# Altium schematic sheet MCU INTERFACE.SchDoc
size OrCAD B; SheetNumber: 1; SheetTotal: 7
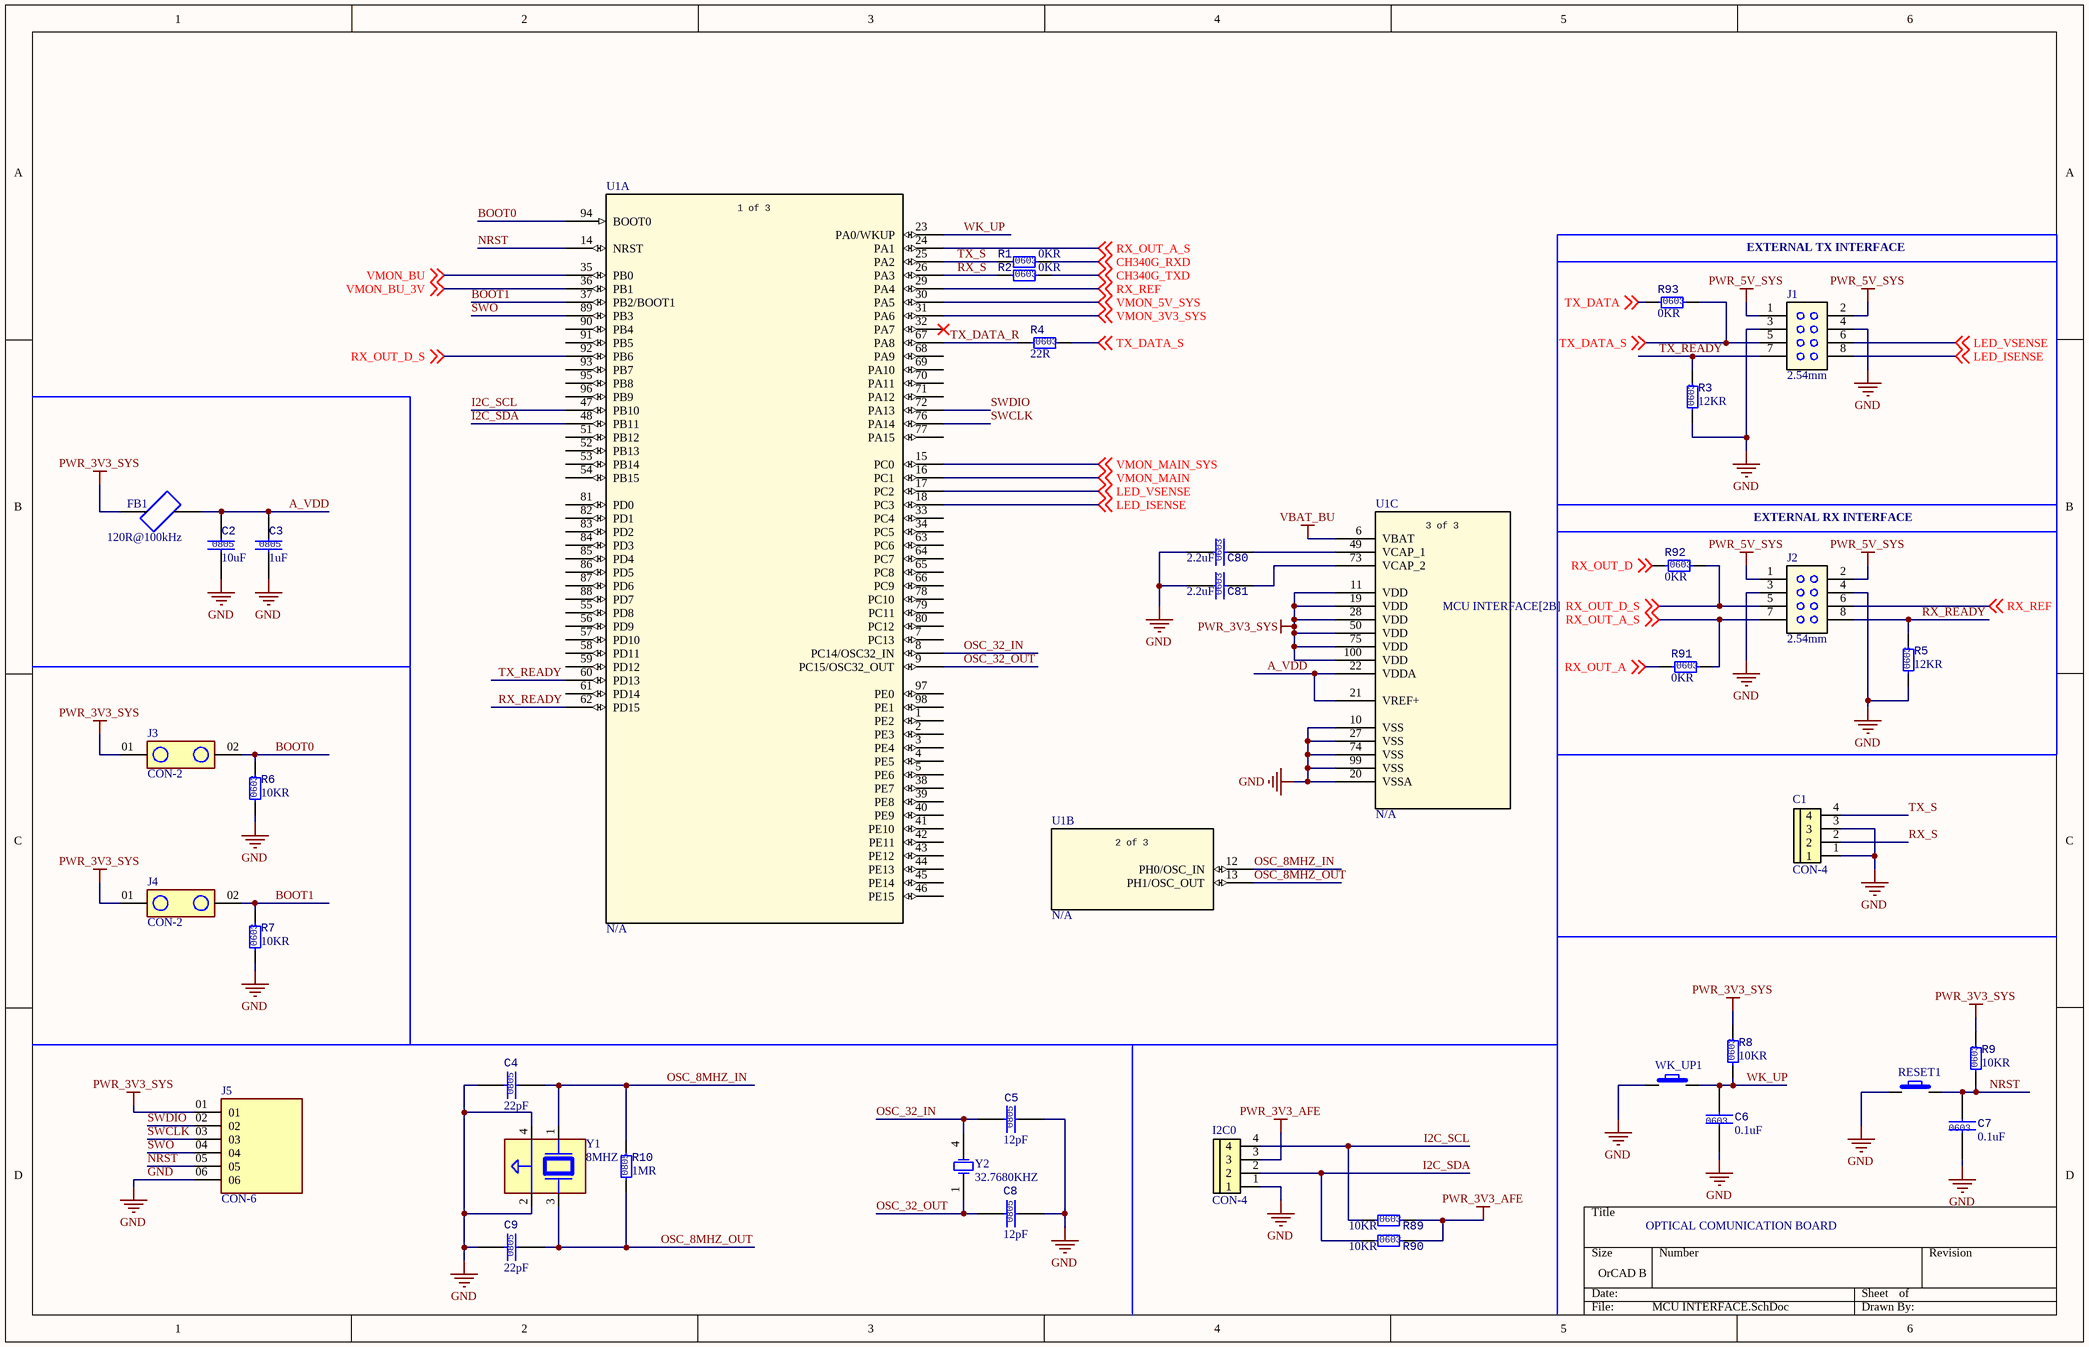
[diagram p0: MCU INTERFACE.SchDoc]

## Parts
C1  value CON-4  [CON-4]  (hidden comment: CONNECTOR_4)
C2  Size: 0805  [CAPCER 0603 SMD]  (hidden comment: 10uF)
C3  Size: 0805  [CAPCER 0805 SMD]  (hidden comment: 1uF)
C4  value 22pF  Size: 0805  [CAPCER 0805 SMD]  (hidden comment: 22uF)
C5  Size: 0805  [CAPCER 0805 SMD]  (hidden comment: 12pF)
C6  Size: 0603  [CAPCER 0805 SMD]  (hidden comment: 0.1uF)
C7  Size: 0603  [CAPCER 0805 SMD]  (hidden comment: 0.1uF)
C8  Size: 0805  [CAPCER 0805 SMD]  (hidden comment: 12pF)
C9  value 22pF  Size: 0805  [CAPCER 0805 SMD]  (hidden comment: 22uF)
C80  Size: 0603  [CAPCER 0603 SMD]  (hidden comment: 2.2uF)
C81  Size: 0603  [CAPCER 0603 SMD]  (hidden comment: 2.2uF)
FB1  120R@100kHz  [FB 0805]
I2C0  value CON-4  [CON-4]  (hidden comment: CONNECTOR_4)
J1  value 2.54mm  [HD_2X4_2P54_M_V]  (hidden comment: HD_2X4_M_V)
J2  value 2.54mm  [HD_2X4_2P54_M_V]  (hidden comment: HD_2X4_M_V)
J3  value CON-2  [CON-2]  (hidden comment: CONNECTOR_2)
J4  value CON-2  [CON-2]  (hidden comment: CONNECTOR_2)
J5  value CON-6  [CON-6]  (hidden comment: CONNECTOR_6)
R1  value 0KR  Size: 0603  [RESC 0603(1608) SMD]  (hidden comment: 0R)
R2  value 0KR  Size: 0603  [RESC 0603(1608) SMD]  (hidden comment: 0R)
R3  Size: 0603  [RESC 0603(1608) SMD]  (hidden comment: 12KR)
R4  Size: 0603  [RESC 0603(1608) SMD]  (hidden comment: 22R)
R5  Size: 0603  [RESC 0603(1608) SMD]  (hidden comment: 12KR)
R6  Size: 0603  [RESC 0603(1608) SMD]  (hidden comment: 10KR)
R7  Size: 0603  [RESC 0603(1608) SMD]  (hidden comment: 10KR)
R8  Size: 0603  [RESC 0603(1608) SMD]  (hidden comment: 10KR)
R9  Size: 0603  [RESC 0603(1608) SMD]  (hidden comment: 10KR)
R10  value 1MR  Size: 0805  [CAPCER 0805 SMD]  (hidden comment: Điện Trở 1 MOhm 0805 1%)
R89  Size: 0603  [RESC 0603(1608) SMD]  (hidden comment: 10KR)
R90  Size: 0603  [RESC 0603(1608) SMD]  (hidden comment: 10KR)
R91  value 0KR  Size: 0603  [RESC 0603(1608) SMD]  (hidden comment: 0R)
R92  value 0KR  Size: 0603  [RESC 0603(1608) SMD]  (hidden comment: 0R)
R93  value 0KR  Size: 0603  [RESC 0603(1608) SMD]  (hidden comment: 0R)
RESET1  BUTTON  [BUTTON_SMD]  (value not drawn)
U1  STM32F407VET6  [100LQFP]  (value not drawn)  (parts A,B,C of 3)
WK_UP1  BUTTON  [BUTTON_SMD]  (value not drawn)
Y1  value 8MHZ  [XTAL_5032]  (hidden comment: XTAL_8Mhz)
Y2  value 32.7680KHZ  [4-SOJ]  (hidden comment: XTAL_32.786K)

## Nets
GND: C1.1 C1.3 C2.2 C3.2 C4.1 C5.2 C6.1 C7.1 C8.2 C9.1 C80.1 C81.1 I2C0.1 J1.3 J1.4 J2.3 J2.4 J5.06 R3.1 R5.1 R6.1 R7.1 RESET1.1 U1.10(VSS) U1.20(VSSA) U1.27(VSS) U1.74(VSS) U1.99(VSS) WK_UP1.1 Y1.2(GND) Y1.4(GND)
PWR_3V3_AFE: I2C0.3 R89.2 R90.2
PWR_3V3_SYS: FB1.1 J3.01 J4.01 J5.01 R8.2 R9.2 U1.11(VDD) U1.19(VDD) U1.28(VDD) U1.50(VDD) U1.75(VDD) U1.100(VDD)
PWR_5V_SYS: J1.1 J1.2 J2.1 J2.2
VBAT_BU: U1.6(VBAT)
A_VDD: C2.1 C3.1 FB1.2 U1.21(VREF+) U1.22(VDDA)
BOOT0: J3.02 R6.2 U1.94(BOOT0)
BOOT1: J4.02 R7.2 U1.37(PB2/BOOT1)
CH340G_RXD: R1.2 ; off-sheet CH340G_RXD
CH340G_TXD: R2.2 ; off-sheet CH340G_TXD
I2C_SCL: I2C0.4 R89.1 U1.47(PB10)
I2C_SDA: I2C0.2 R90.1 U1.48(PB11)
LED_ISENSE: J1.8 U1.18(PC3) ; off-sheet LED_ISENSE
LED_VSENSE: J1.6 U1.17(PC2) ; off-sheet LED_VSENSE
NRST: C7.2 J5.05 R9.1 RESET1.2 U1.14(NRST)
OSC_8MHZ_IN: C4.2 R10.2 U1.12(PH0/OSC_IN) Y1.1
OSC_8MHZ_OUT: C9.2 R10.1 U1.13(PH1/OSC_OUT) Y1.3
OSC_32_IN: C5.1 U1.8(PC14/OSC32_IN) Y2.4(OSC2)
OSC_32_OUT: C8.1 U1.9(PC15/OSC32_OUT) Y2.1(OSC1)
RX_OUT_A: R91.1 ; off-sheet RX_OUT_A
RX_OUT_A_S: J2.7 R91.2 U1.24(PA1) ; off-sheet RX_OUT_A_S
RX_OUT_D: R92.1 ; off-sheet RX_OUT_D
RX_OUT_D_S: J2.5 R92.2 U1.92(PB6) ; off-sheet RX_OUT_D_S
RX_READY: J2.8 R5.2 U1.62(PD15)
RX_REF: J2.6 U1.29(PA4) ; off-sheet RX_REF
RX_S: C1.2 R2.1 U1.26(PA3)
SWCLK: J5.03 U1.76(PA14)
SWDIO: J5.02 U1.72(PA13)
SWO: J5.04 U1.89(PB3)
TX_DATA: R93.1 ; off-sheet TX_DATA
TX_DATA_R: R4.1 U1.67(PA8)
TX_DATA_S: J1.5 R4.2 R93.2 ; off-sheet TX_DATA_S
TX_READY: J1.7 R3.2 U1.60(PD13)
TX_S: C1.4 R1.1 U1.25(PA2)
VMON_3V3_SYS: U1.31(PA6) ; off-sheet VMON_3V3_SYS
VMON_5V_SYS: U1.30(PA5) ; off-sheet VMON_5V_SYS
VMON_BU: U1.35(PB0) ; off-sheet VMON_BU
VMON_BU_3V: U1.36(PB1) ; off-sheet VMON_BU_3V
VMON_MAIN: U1.16(PC1) ; off-sheet VMON_MAIN
VMON_MAIN_SYS: U1.15(PC0) ; off-sheet VMON_MAIN_SYS
WK_UP: C6.2 R8.1 U1.23(PA0/WKUP) WK_UP1.2
NetC80_2: C80.2 U1.49(VCAP_1)
NetC81_2: C81.2 U1.73(VCAP_2)

Not connected (* = marked no-connect by the designer): U1 1(PE2) 2(PE3) 3(PE4) 4(PE5) 5(PE6) 7(PC13) 32(PA7)* 33(PC4) 34(PC5) 38(PE7) 39(PE8) 40(PE9) 41(PE10) 42(PE11) 43(PE12) 44(PE13) 45(PE14) 46(PE15) 51(PB12) 52(PB13) 53(PB14) 54(PB15) 55(PD8) 56(PD9) 57(PD10) 58(PD11) 59(PD12) 61(PD14) 63(PC6) 64(PC7) 65(PC8) 66(PC9) 68(PA9) 69(PA10) 70(PA11) 71(PA12) 77(PA15) 78(PC10) 79(PC11) 80(PC12) 81(PD0) 82(PD1) 83(PD2) 84(PD3) 85(PD4) 86(PD5) 87(PD6) 88(PD7) 90(PB4) 91(PB5) 93(PB7) 95(PB8) 96(PB9) 97(PE0) 98(PE1)

## Notes on the sheet
- EXTERNAL TX INTERFACE
- EXTERNAL RX INTERFACE
- OPTICAL COMUNICATION BOARD
- (in symbol DB-0071, part A) 1 of 3
- (in symbol DB-0071, part B) 2 of 3
- (in symbol DB-0071, part C) 3 of 3

## Library data of the parts
C1 I2C0 = DB-0049: Hàng Rào Đực Đơn 2.54mm 40 Chân 1 Hàng Cao 11.2mm Xuyên Lỗ; Design Item ID: DB-0049; Type: CONNECTOR; Power Rate: N/A; Tolerance: N/A; Footprint Type: TFT; Size: TFT; Supplier: THEGIOIIC; Supplier Part Number: Hàng Rào Đực Đơn 2.54mm 40 Chân 1 Hàng Cao 11.2mm Xuyên Lỗ; Supplier Link: https://www.thegioiic.com/hang-rao-duc-don-2-54mm-40-chan-1-hang-cao-11-2mm-xuyen-lo
C2 = DB-0018: CAPACITOR SMD 10uF 25V 10% 0805; Design Item ID: DB-0018; Value: 10uF; Type: CAPACITOR; Power Rate: N/A; Tolerance: 10%; Footprint Type: SMD; Supplier: THEGIOIIC; Supplier Part Number: Tụ Gốm 0805 10uF 25V; Supplier Link: https://www.thegioiic.com/tu-gom-0805-10uf-25v
C3 = DB-0063: CAPACITOR SMD 1uF 16V 10% 0805; Value: 1uF; Design Item ID: DB-0063; Type: CAPACITOR; Power Rate: N/A; Tolerance: 10%; Footprint Type: SMD; Supplier: THEGIOIIC; Supplier Part Number: Tụ Gốm 0805 1uF 16V; Supplier Link: https://www.thegioiic.com/tu-gom-0805-1uf-16v
C4 C9 = DB-0047: CAPACITOR SMD 22pF 50V 10% 0805; Design Item ID: DB-0047; Type: CAPACITOR; Power Rate: N/A; Tolerance: 10%; Footprint Type: SMD; Supplier: THEGIOIIC; Supplier Part Number: Tụ Gốm 0805 22pF 50V; Supplier Link: https://www.thegioiic.com/tu-gom-0805-22pf-50v
C5 C8 = DB-0075: CAPACITOR SMD 12pF 50V 10% 0805; Design Item ID: DB-0075; Type: CAPACITOR; Power Rate: N/A; Value: 12pF; Tolerance: 10%; Footprint Type: SMD; Supplier: THEGIOIIC; Supplier Part Number: Tụ Gốm 0805 12pF 50V; Supplier Link: https://www.thegioiic.com/tu-gom-0805-4-7uf-50v
C6 C7 = DB-0017: CAPACITOR SMD 0.1uF 50V 10% 0603; Value: 0.1uF; Design Item ID: DB-0017; Type: CAPACITOR; Power Rate: N/A; Tolerance: 10%; Footprint Type: SMD; Supplier: THEGIOIIC; Supplier Part Number: Tụ Gốm 0603 100nF (0.1uF) 25V; Supplier Link: https://www.thegioiic.com/tu-gom-0603-100nf-0-1uf-25v
C80 C81 = Tụ Gốm 0603 2.2uF 50V: Value: 2.2uF; Design Item ID: DB-0027; Footprint Type: SMD; Supplier: THEGIOIIC; Supplier Link: https://www.thegioiic.com/tu-gom-0603-2-2uf-50v
FB1 = DB-0076: CBW201209U121T Ferrite Beads 2A 120 Ohm 0805; Design Item ID: DB-0076; Value: 120R@100kHz; Type: FERRITE BEADS; Power Rate: N/A; Tolerance: N/A; Footprint Type: SMD; Size: 0805; Supplier: THEGIOIIC; Supplier Part Number: CBW201209U121T Ferrite Beads 2A 120 Ohm 0805; Supplier Link: https://www.thegioiic.com/cbw201209u121t-ferrite-beads-2a-120-ohm-0805
J1 J2 = DB-0006: Design Item ID: DB-0006; Type: HEADER; Footprint Type: THT; Size: HD_2X4_FM_RA; Supplier: THEGIOIIC; Supplier Link: https://www.thegioiic.com/hang-rao-duc-doi-2-54mm-80-chan-2-hang-cao-11-2mm-xuyen-lo-chan-ma-vang
J3 J4 = DB-0085: Hàng Rào Đực Đơn 2.54mm 40 Chân 1 Hàng Cao 11.2mm Xuyên Lỗ; Design Item ID: DB-0085; Type: CONNECTOR; Power Rate: N/A; Tolerance: N/A; Footprint Type: TFT; Size: TFT; Supplier: THEGIOIIC; Supplier Part Number: Hàng Rào Đực Đơn 2.54mm 40 Chân 1 Hàng Cao 11.2mm Xuyên Lỗ; Supplier Link: https://www.thegioiic.com/hang-rao-duc-don-2-54mm-40-chan-1-hang-cao-11-2mm-xuyen-lo
J5 = DB-0084: Hàng Rào Đực Đơn 2.54mm 40 Chân 1 Hàng Cao 11.2mm Xuyên Lỗ; Design Item ID: DB-0084; Type: CONNECTOR; Power Rate: N/A; Tolerance: N/A; Footprint Type: TFT; Size: TFT; Supplier: THEGIOIIC; Supplier Part Number: Hàng Rào Đực Đơn 2.54mm 40 Chân 1 Hàng Cao 11.2mm Xuyên Lỗ; Supplier Link: https://www.thegioiic.com/hang-rao-duc-don-2-54mm-40-chan-1-hang-cao-11-2mm-xuyen-lo
R1 R2 R91-R93 = DB-0040: RESISTOR SMD 0KR OHM 1% 100mW 0603; Power Rate: 100mW; Design Item ID: DB-0040; Type: RESISTOR; Tolerance: 1%; Footprint Type: SMD; Supplier: THEGIOIIC; Supplier Part Number: Điện Trở 0 Ohm 0603 1%; Supplier Link: https://www.thegioiic.com/dien-tro-0-ohm-0603-1-
R3 R5 = DB-0027: RESISTOR SMD 12KR OHM 1% 100mW 0603; Power Rate: 100mW; Design Item ID: DB-0027; Value: 12KR; Type: RESISTOR; Tolerance: 1%; Footprint Type: SMD; Supplier: THEGIOIIC; Supplier Part Number: Điện Trở 12 KOhm 0603 1%; Supplier Link: https://www.thegioiic.com/dien-tro-12-kohm-0603-1-
R4 = DB-0007: Power Rate: *; Design Item ID: DB-0007; Value: 22R; Type: RESISTOR; Footprint Type: SMD; Supplier: THEGIOIIC; Supplier Link: https://www.thegioiic.com/dien-tro-22-ohm-0603-1-
R6-R9 R89 R90 = DB-0003: RESISTOR SMD 10KR OHM 1% 100mW 0603; Power Rate: 100mW; Design Item ID: DB-0003; Value: 10KR; Type: RESISTOR; Tolerance: 1%; Footprint Type: SMD; Supplier: THEGIOIIC; Supplier Part Number: Điện Trở 10 KOhm 0603 1%; Supplier Link: https://www.thegioiic.com/dien-tro-10-kohm-0603-1-
R10 = DB-0074: RESISTOR SMD 1 MOHM 1% 100mW 0805; Power Rate: 100mW; Design Item ID: DB-0074; Type: RESISTOR; Tolerance: 1%; Footprint Type: SMD; Supplier: THEGIOIIC; Supplier Part Number: Điện Trở 1 MOhm 0805 1%; Supplier Link: https://www.thegioiic.com/dien-tro-1-mohm-0805-1-
RESET1 WK_UP1 = DB-0051: Nút Nhấn 4x4mm Cao 1.5mm 4 Chân SMD Chống Nước; Value: N/A; Design Item ID: DB-0051; Type: BUTTON; Power Rate: N/A; Tolerance: N/A; Footprint Type: SMD; Size: BUTTON_SMD; Supplier: THEGIOIIC; Supplier Part Number: Nút Nhấn 4x4mm Cao 1.5mm 4 Chân SMD Chống Nước; Supplier Link: https://www.thegioiic.com/nut-nhan-4x4mm-cao-1-5mm-4-chan-smd-chong-nuoc
U1 = DB-0071: IC MCU 32BIT 512KB FLASH 100LQFP; Design Item ID: DB-0071; Value: N/A; Type: MCU; Power Rate: N/A; Tolerance: N/A; Footprint Type: SMD; Size: 100LQFP; Supplier: THEGIOIIC
Y1 = DB-0008: Design Item ID: DB-0008; Type: XTAL; Footprint Type: SMD; Size: 5033; Supplier: THEGIOIIC; Supplier Link: https://www.thegioiic.com/thach-anh-12mhz-5032-4-chan-smd
Y2 = DB-0064: CRYSTAL 32.7680KHZ 12.5PF SMD; Design Item ID: DB-0064; Type: XTAL; Power Rate: N/A; Tolerance: N/A; Footprint Type: SMD; Size: 4-SOJ; Supplier: THEGIOIIC; Supplier Part Number: Thạch Anh 32.768KHz MC-306 4 Chân; Supplier Link: https://www.thegioiic.com/thach-anh-32-768khz-mc-306-4-chan